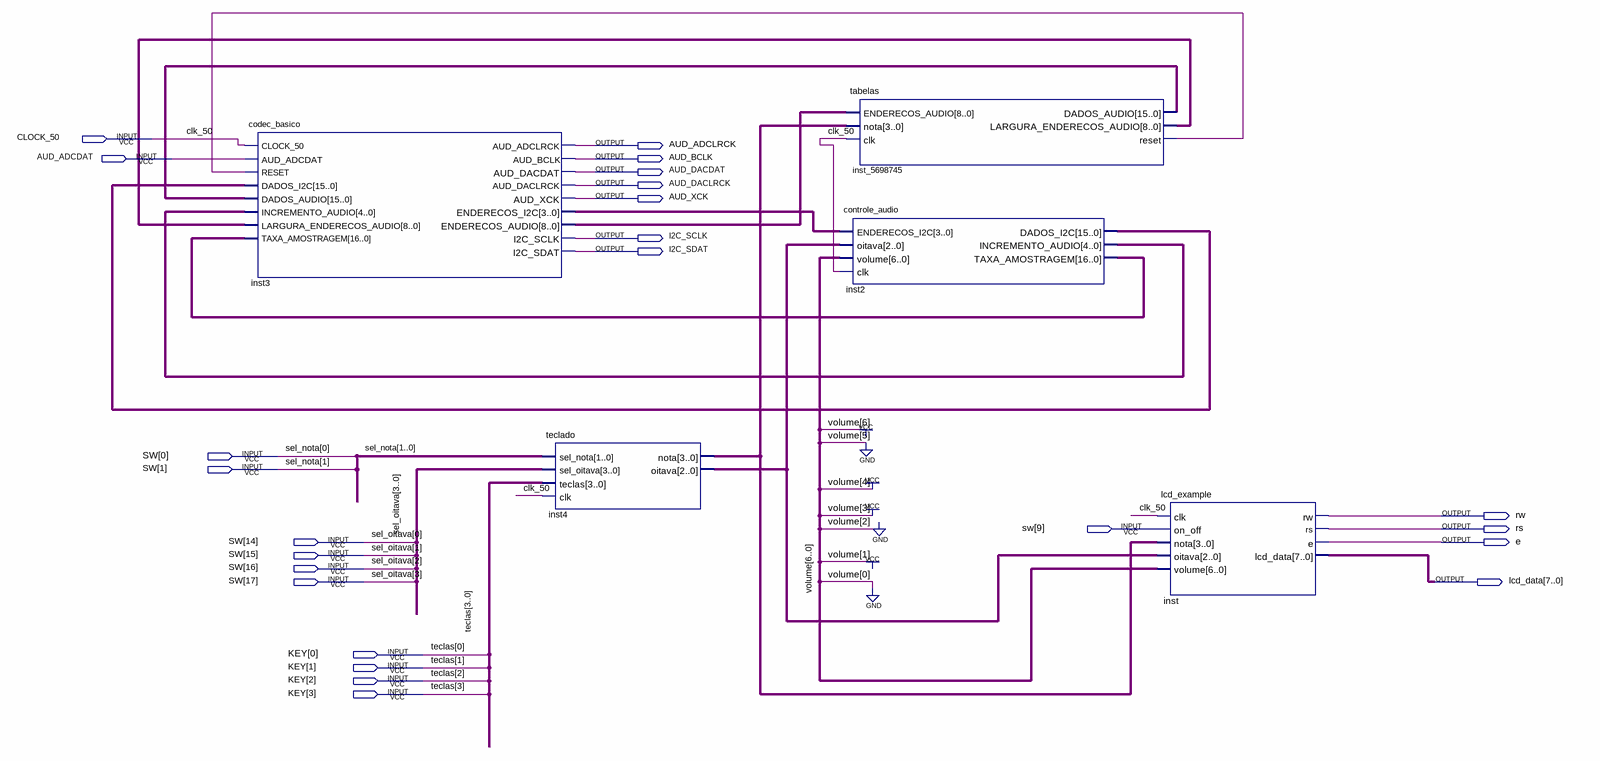
[diagram p0: schematic sheet]
// Quartus schematic keyboard.bdf as structural Verilog: 5 symbols, 24 pins
module keyboard (
  input  CLOCK_50,
  input  AUD_ADCDAT,
  input  [17:0] SW,
  input  [3:0] KEY,
  output AUD_ADCLRCK,
  output AUD_BCLK,
  output AUD_DACDAT,
  output AUD_DACLRCK,
  output AUD_XCK,
  output I2C_SCLK,
  output I2C_SDAT,
  output rw,
  output rs,
  output e,
  output [7:0] lcd_data
);

  wire inst_5698745_reset;
  wire [2:0] inst4_oitava;
  wire [3:0] inst3_enderecos_i2c, inst4_nota;
  wire [4:0] inst2_incremento_audio;
  wire [8:0] inst3_enderecos_audio, inst_5698745_largura_enderecos_audio;
  wire [15:0] inst2_dados_i2c, inst_5698745_dados_audio;
  wire [16:0] inst2_taxa_amostragem;

  codec_basico inst3 (
    .CLOCK_50(CLOCK_50), .AUD_ADCDAT(AUD_ADCDAT), .RESET(inst_5698745_reset), .DADOS_I2C(inst2_dados_i2c),
    .DADOS_AUDIO(inst_5698745_dados_audio), .INCREMENTO_AUDIO(inst2_incremento_audio),
    .LARGURA_ENDERECOS_AUDIO(inst_5698745_largura_enderecos_audio), .TAXA_AMOSTRAGEM(inst2_taxa_amostragem),
    .AUD_DACDAT(AUD_DACDAT), .AUD_XCK(AUD_XCK), .ENDERECOS_I2C(inst3_enderecos_i2c),
    .ENDERECOS_AUDIO(inst3_enderecos_audio), .I2C_SCLK(I2C_SCLK), .AUD_ADCLRCK(AUD_ADCLRCK),
    .AUD_BCLK(AUD_BCLK), .AUD_DACLRCK(AUD_DACLRCK), .I2C_SDAT(I2C_SDAT));
  teclado inst4 (
    .sel_nota(SW[1:0]), .sel_oitava(SW[17:14]), .teclas(KEY), .clk(CLOCK_50), .nota(inst4_nota),
    .oitava(inst4_oitava));
  tabelas inst_5698745 (
    .ENDERECOS_AUDIO(inst3_enderecos_audio), .nota(inst4_nota), .clk(CLOCK_50),
    .DADOS_AUDIO(inst_5698745_dados_audio), .LARGURA_ENDERECOS_AUDIO(inst_5698745_largura_enderecos_audio),
    .reset(inst_5698745_reset));
  controle_audio inst2 (
    .ENDERECOS_I2C(inst3_enderecos_i2c), .oitava(inst4_oitava), .volume(7'b1011010), .clk(CLOCK_50),
    .DADOS_I2C(inst2_dados_i2c), .INCREMENTO_AUDIO(inst2_incremento_audio),
    .TAXA_AMOSTRAGEM(inst2_taxa_amostragem));
  lcd_example inst (
    .clk(CLOCK_50), .on_off(SW[9]), .nota(inst4_nota), .oitava(inst4_oitava), .volume(7'b1011010), .rw(rw),
    .rs(rs), .e(e), .lcd_data(lcd_data));

  // Other names for the same wires on the sheet: clk_50 = CLOCK_50; sel_nota[1:0] = SW[1:0];
  //   sel_oitava[3:0] = SW[17:14]; teclas[3:0] = KEY
endmodule
